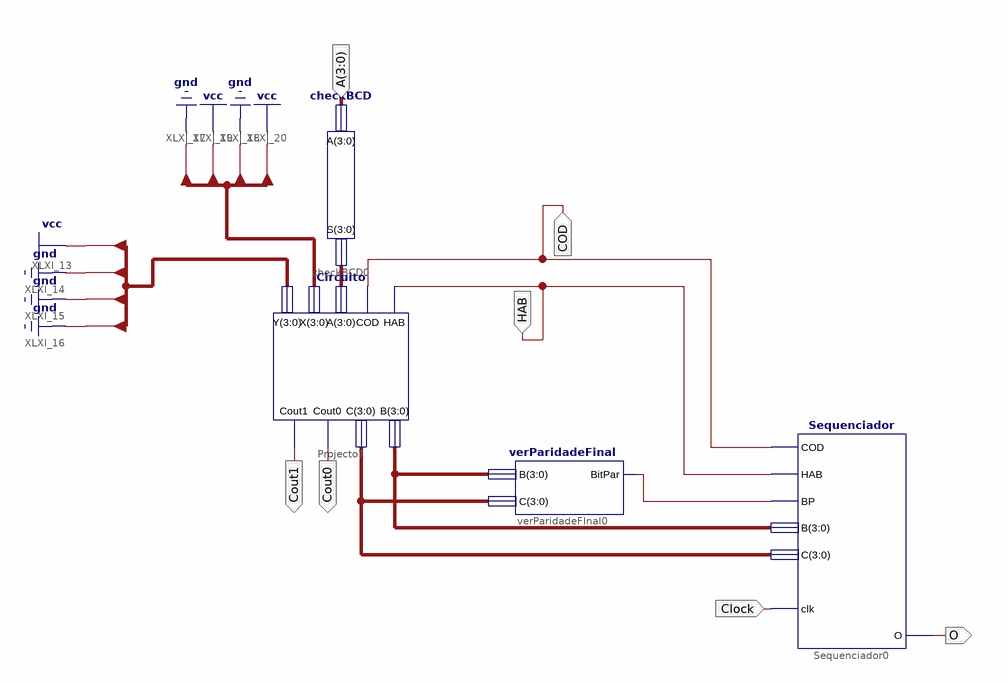
[diagram p0: schematic sheet 1]
// Xilinx ISE schematic CircuitoFinal.sch (spartan3e) as structural Verilog: 4 symbols, 7 ports
module CircuitoFinal (
  input  COD,
  input  HAB,
  input  Clock,
  input  [3:0] A,
  output Cout1,
  output Cout0,
  output O
);

  wire XLXN_48;
  wire [3:0] XLXN_2, XLXN_3, XLXN_50;

  Circuito Projecto1 (
    .HAB(HAB), .COD(COD), .A(XLXN_50), .X(4'b0101), .Y(4'b0001), .B(XLXN_2), .C(XLXN_3), .Cout0(Cout0),
    .Cout1(Cout1));
  verParidadeFinal verParidadeFInal0 (.B(XLXN_2), .C(XLXN_3), .BitPar(XLXN_48));
  Sequenciador Sequenciador0 (.BP(XLXN_48), .HAB(HAB), .COD(COD), .clk(Clock), .B(XLXN_2), .C(XLXN_3), .O(O));
  checkBCD checkBCD0 (.A(A), .S(XLXN_50));
endmodule
